# EAGLE design measure_station (EAGLE 8.7.1)
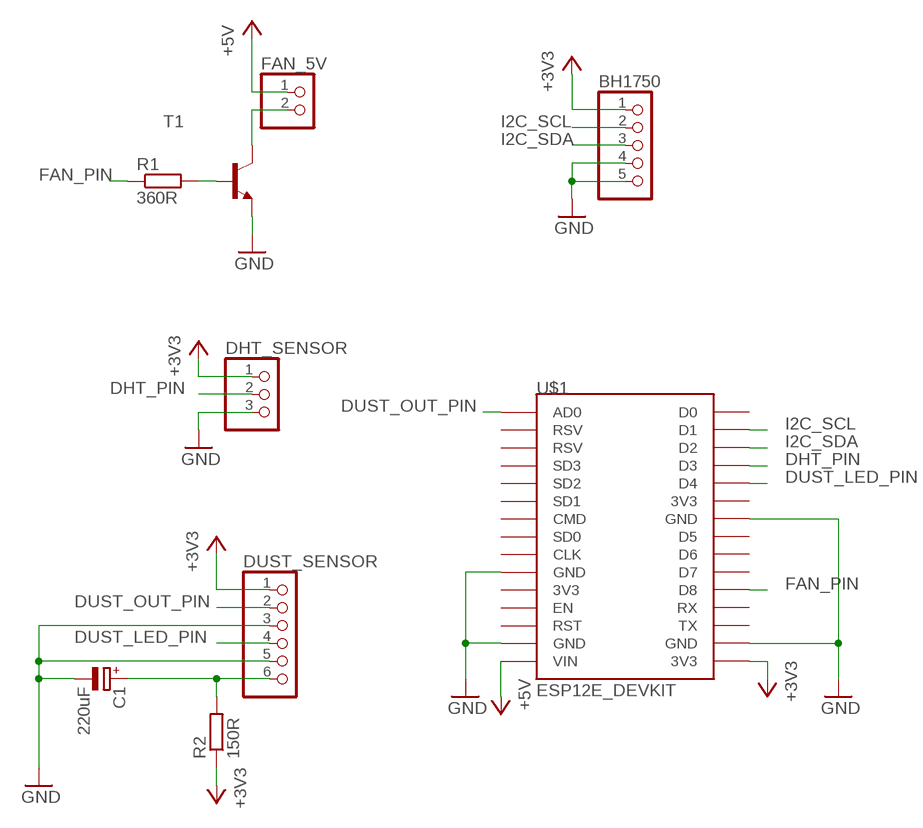
[diagram p0: schematic, sheet 1]

## Parts
BH1750  PINHD-1X5  [1X05]
C1  220uF  CPOL-EUE2.5-5  [E2,5-5]
DHT_SENSOR  PINHD-1X3  [1X03]
DUST_SENSOR  PINHD-1X6  [1X06]
FAN_5V  PINHD-1X2  [1X02]
R1  360R  R-EU_0204/7  [0204/7]
R2  150R  R-EU_0204/7  [0204/7]
T1  MPS2222A-NPN-TO92-CBE  [TO92-CBE]
U$1  ESP12E_DEVKIT  [ESP12E_DEVKIT]

## Nets
+3V3: BH1750.1 DHT_SENSOR.1 DUST_SENSOR.1 R2.1 U$1.3V3@2(3V3)
+5V: FAN_5V.1 U$1.VIN
DHT_PIN: DHT_SENSOR.2 U$1.D3
DUST_LED_PIN: DUST_SENSOR.4 U$1.D4
DUST_OUT_PIN: DUST_SENSOR.2 U$1.AD0
FAN_PIN: R1.1 U$1.D8
GND: BH1750.4 BH1750.5 C1.- DHT_SENSOR.3 DUST_SENSOR.3 DUST_SENSOR.5 T1.E U$1.GND@0(GND) U$1.GND@1(GND) U$1.GND@2(GND) U$1.GND@3(GND)
I2C_SCL: BH1750.2 U$1.D1
I2C_SDA: BH1750.3 U$1.D2
N$1: FAN_5V.2 T1.C
N$2: R1.2 T1.B
N$3: C1.+ DUST_SENSOR.6 R2.2
Unconnected: U$1.3V3@0(3V3) U$1.3V3@1(3V3) U$1.CLK U$1.CMD U$1.D0 U$1.D5 U$1.D6 U$1.D7 U$1.EN U$1.RST U$1.RSV@0(RSV) U$1.RSV@1(RSV) U$1.RX U$1.SD0 U$1.SD1 U$1.SD2 U$1.SD3 U$1.TX

## Library data of the parts
BH1750 = pinhead:PINHD-1X5: PIN HEADER
C1 = rcl:CPOL-EU: POLARIZED CAPACITOR, European symbol; SPICEPREFIX: C
DHT_SENSOR = pinhead:PINHD-1X3: PIN HEADER
DUST_SENSOR = pinhead:PINHD-1X6: PIN HEADER
FAN_5V = pinhead:PINHD-1X2: PIN HEADER
R1 R2 = resistor:R-EU_: RESISTOR, European symbol
T1 = transistor:*-NPN-: NPN Transistror BF959 corrected 2008.03.06
U$1 = ESP12E_DEVKIT:ESP12E_DEVKIT: ESP12E DEVKIT BOARD

## Board
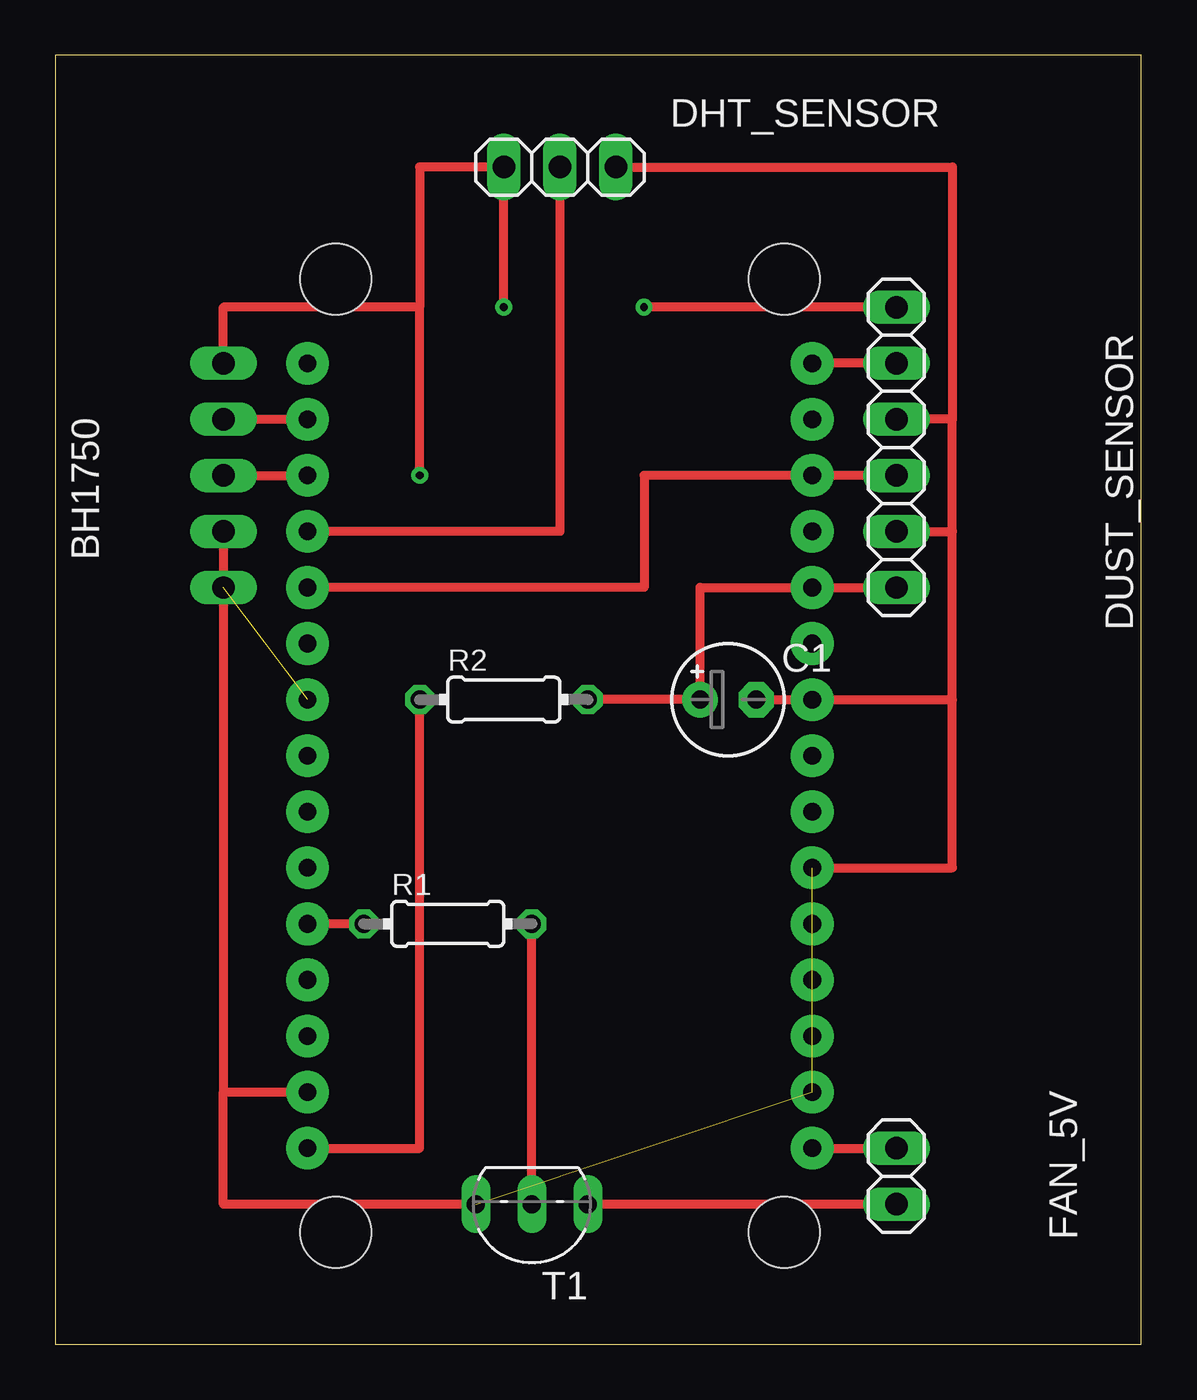
[diagram p1: board, top side]
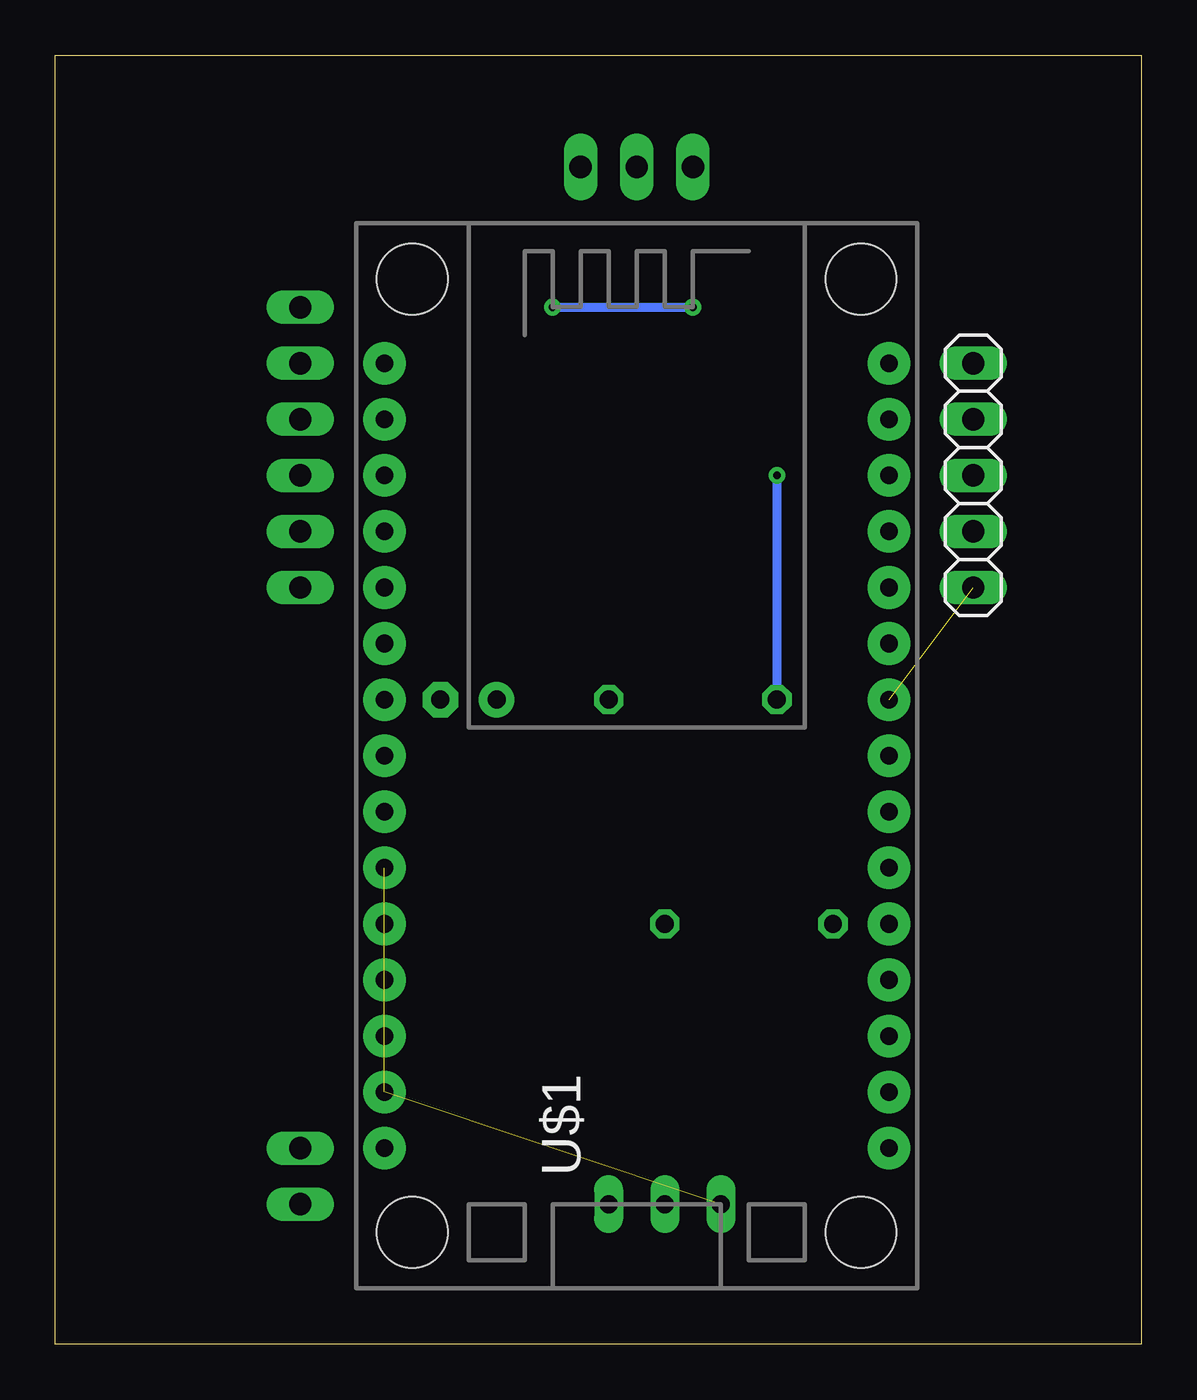
[diagram p2: board, bottom side, seen from below]

Size 49.2 x 58.41 mm. Coordinates in mm from the lower left corner, seen from the top.
Outline: 0,0 49.2,0 49.2,58.41 0,58.41 0,0
Copper layers (1*16): Top 0.035mm / dielectric 1.5mm / Bottom 0.035mm
Design rules "default": minimum track width 6mil, minimum drill 0.35mm, track to track 6mil, track to pad 6mil, pad to pad 6mil, via to via 6mil, smd to smd 6mil, copper to edge 40mil, drill to drill 6mil, minimum pad ring 10mil, minimum via ring 8mil, stop-mask expansion 4mil, vias tented up to drill 0mil, thermal gap 10mil

### Footprints (pad centres in the part's own frame; a part is rotated, then mirrored left to right if it is on the bottom)
1X05 = drill 1.016 long: 1 -5.08,0; 2 -2.54,0; 3 0,0; 4 2.54,0; 5 5.08,0
E2,5-5 = drill 0.813 pad 1.6: + -1.27,0 | drill 0.813 pad 1.6 octagon: - 1.27,0
1X03 = drill 1.016 long: 1 -2.54,0; 2 0,0; 3 2.54,0
1X06 = drill 1.016 long: 1 -6.35,0; 2 -3.81,0; 3 -1.27,0; 4 1.27,0; 5 3.81,0; 6 6.35,0
1X02 = drill 1.016 long: 1 -1.27,0; 2 1.27,0
0204/7 = drill 0.813 octagon: 1 -3.81,0; 2 3.81,0
TO92-CBE = drill 0.813 long: B 0,0; C -2.54,0; E 2.54,0
ESP12E_DEVKIT = drill 0.8 pad 1.93: 3V3@0 -11.43,-7.62; 3V3@1 11.43,5.08; 3V3@2 11.43,-17.78; AD0 -11.43,17.78; CLK -11.43,-2.54; CMD -11.43,2.54; D0 11.43,17.78; D1 11.43,15.24; D2 11.43,12.7; D3 11.43,10.16; D4 11.43,7.62; D5 11.43,0; D6 11.43,-2.54; D7 11.43,-5.08; D8 11.43,-7.62; EN -11.43,-10.16; GND@0 -11.43,-5.08; GND@1 -11.43,-15.24; GND@2 11.43,2.54; GND@3 11.43,-15.24; RST -11.43,-12.7; RSV@0 -11.43,15.24; RSV@1 -11.43,12.7; RX 11.43,-10.16; SD0 -11.43,0; SD1 -11.43,5.08; SD2 -11.43,7.62; SD3 -11.43,10.16; TX 11.43,-12.7; VIN -11.43,-17.78 | hole 3.2: -10.16,21.59; 10.16,21.59; 10.16,-21.59; -10.16,-21.59

### Placement (x,y rotation side)
BH1750  7.62,39.37 270 bottom
C1  30.48,29.21 0 top
DHT_SENSOR  22.86,53.34 0 top
DUST_SENSOR  38.1,40.64 270 top
FAN_5V  38.1,7.62 270 top
R1  17.78,19.05 0 top
R2  20.32,29.21 0 top
T1  21.59,6.35 180 top
U$1  22.86,26.67 0 bottom

### Tracks (layer width: path | path; a pad name or v marks a point on that pad's centre or on a via)
+3V3  (via drill 0.35)
  Top 0.406: U$1.3V3@2 16.51,8.89 R2.1 | 16.51,46.99 7.62,46.99 BH1750.1 | v16.51,39.37 16.51,46.99 | 16.51,46.99 16.51,53.34 DHT_SENSOR.1 v20.32,46.99 | DUST_SENSOR.1 v26.67,46.99
  Bottom 0.406: v16.51,39.37 R2.1 | v26.67,46.99 v20.32,46.99
+5V
  Top 0.406: U$1.VIN FAN_5V.1
DHT_PIN
  Top 0.406: U$1.D3 22.86,36.83 DHT_SENSOR.2
DUST_LED_PIN
  Top 0.406: DUST_SENSOR.4 26.67,39.37 26.67,34.29 U$1.D4
DUST_OUT_PIN
  Top 0.406: DUST_SENSOR.2 U$1.AD0
FAN_PIN
  Top 0.406: R1.1 U$1.D8
GND  (3 unrouted)
  Top 0.406: BH1750.4 BH1750.5 7.62,11.43 | 7.62,11.43 U$1.GND@3 | T1.E 7.62,6.35 7.62,11.43 | DUST_SENSOR.5 40.64,36.83 | 40.64,36.83 40.64,41.91 | 40.64,41.91 DUST_SENSOR.3 | C1.- 40.64,29.21 | 40.64,29.21 40.64,36.83 | DHT_SENSOR.3 40.64,53.34 40.64,41.91 | U$1.GND@0 40.64,21.59 40.64,29.21
I2C_SCL
  Top 0.406: BH1750.2 U$1.D1
I2C_SDA
  Top 0.406: BH1750.3 U$1.D2
N$1
  Top 0.406: FAN_5V.2 T1.C
N$2
  Top 0.406: T1.B R1.2
N$3
  Top 0.406: DUST_SENSOR.6 29.21,34.29 C1.+ R2.2

### Text on the board
silk: 3v3 | SIG | GND | 3v3 (red) | 3v3 | OUT | SCL | GND | SDA | LED | ADD | GND | GND | ANODE | 5V | GND